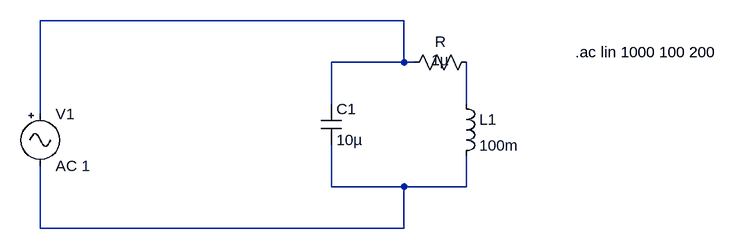
[diagram p0: schematic Tank_circuit.asc]
Tank_circuit.asc, the LTspice schematic file:
Version 4.1
SHEET 1 1144 680
WIRE 640 -16 80 -16
WIRE 640 48 640 -16
WIRE 640 48 528 48
WIRE 656 48 640 48
WIRE 528 112 528 48
WIRE 736 112 736 48
WIRE 80 128 80 -16
WIRE 528 240 528 176
WIRE 640 240 528 240
WIRE 736 240 736 192
WIRE 736 240 640 240
WIRE 80 304 80 208
WIRE 640 304 640 240
WIRE 640 304 80 304
SYMBOL Misc\\signal 80 112 R0
WINDOW 123 0 0 Left 0
WINDOW 39 0 0 Left 0
SYMATTR InstName V1
SYMATTR Value AC 1
SYMBOL cap 512 112 R0
SYMATTR InstName C1
SYMATTR Value 10µ
SYMATTR SpiceLine Rser=0
SYMBOL ind 720 96 R0
SYMATTR InstName L1
SYMATTR Value 100m
SYMATTR SpiceLine Rser=0
SYMBOL res 752 32 R90
WINDOW 0 0 56 VBottom 2
WINDOW 3 28 56 VBottom 2
SYMATTR InstName R
SYMATTR Value 1µ
TEXT 904 32 Left 2 !.ac lin 1000 100 200

The netlist it stands for:
* Tank_circuit.asc
V1 N001 N003 AC 1
C1 N001 N003 10µ Rser=0
L1 N002 N003 100m Rser=0
R N002 N001 1µ
.ac lin 1000 100 200
.backanno
.end